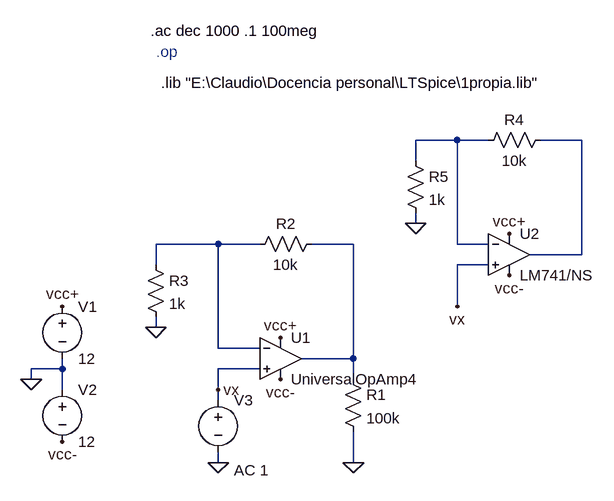
[diagram p0: schematic operacional 1.asc]
operacional 1.asc, the LTspice schematic file:
Version 4
SHEET 1 880 680
WIRE 592 -176 528 -176
WIRE 640 -176 592 -176
WIRE 784 -176 720 -176
WIRE 528 -144 528 -176
WIRE 528 -48 528 -64
WIRE 224 -16 128 -16
WIRE 288 -16 224 -16
WIRE 432 -16 368 -16
WIRE 592 -16 592 -176
WIRE 640 -16 592 -16
WIRE 784 0 784 -176
WIRE 784 0 704 0
WIRE 128 16 128 -16
WIRE 640 16 592 16
WIRE 592 80 592 16
WIRE 128 112 128 96
WIRE 224 144 224 -16
WIRE 288 144 224 144
WIRE 432 160 432 -16
WIRE 432 160 352 160
WIRE -16 176 -16 160
WIRE -16 176 -64 176
WIRE 288 176 224 176
WIRE -64 192 -64 176
WIRE 432 192 432 160
WIRE -16 208 -16 176
WIRE 224 208 224 176
WIRE 224 224 224 208
WIRE 224 320 224 304
WIRE 432 320 432 272
FLAG -64 192 0
FLAG -16 80 vcc+
FLAG -16 288 vcc-
FLAG 320 128 vcc+
FLAG 320 192 vcc-
FLAG 128 112 0
FLAG 224 320 0
FLAG 432 320 0
FLAG 672 -32 vcc+
FLAG 672 32 vcc-
FLAG 528 -48 0
FLAG 224 208 vx
FLAG 592 80 vx
DATAFLAG 432 48 ""
DATAFLAG 784 -48 ""
SYMBOL OpAmps\\UniversalOpAmp4 320 160 R0
SYMATTR InstName U1
SYMBOL voltage -16 64 R0
WINDOW 123 0 0 Left 0
WINDOW 39 0 0 Left 0
SYMATTR InstName V1
SYMATTR Value 12
SYMBOL voltage -16 192 R0
WINDOW 123 0 0 Left 0
WINDOW 39 0 0 Left 0
SYMATTR InstName V2
SYMATTR Value 12
SYMBOL voltage 224 208 R0
WINDOW 123 24 124 Left 2
WINDOW 39 0 0 Left 0
SYMATTR Value2 AC 1
SYMATTR InstName V3
SYMATTR Value ""
SYMBOL res 416 176 R0
SYMATTR InstName R1
SYMATTR Value 100k
SYMBOL res 384 -32 R90
WINDOW 0 0 56 VBottom 2
WINDOW 3 32 56 VTop 2
SYMATTR InstName R2
SYMATTR Value 10k
SYMBOL res 112 0 R0
SYMATTR InstName R3
SYMATTR Value 1k
SYMBOL OpAmps\\opamp2 672 -64 R0
SYMATTR InstName U2
SYMATTR Value LM741/NS
SYMBOL res 736 -192 R90
WINDOW 0 0 56 VBottom 2
WINDOW 3 32 56 VTop 2
SYMATTR InstName R4
SYMATTR Value 10k
SYMBOL res 512 -160 R0
SYMATTR InstName R5
SYMATTR Value 1k
TEXT 128 -312 Left 2 ;.op
TEXT 120 -344 Left 2 !.ac dec 1000 .1 100meg
TEXT 136 -264 Left 2 !.lib "E:\\Claudio\\Docencia personal\\LTSpice\\1propia.lib"

The netlist it stands for:
* operacional 1.asc
* U1: UniversalOpAmp4 (symbol OpAmps\UniversalOpAmp4 not available, pins judged from their places): In+=vx In-=N003 V+=vcc+ V-=vcc- OUT=N004
V1 vcc+ 0 12
V2 0 vcc- 12
V3 vx 0 AC 1
R1 N004 0 100k
R2 N004 N003 10k
R3 N003 0 1k
XU2 vx N001 vcc+ vcc- N002 LM741/NS  ; pins In+ In- V+ V- OUT
R4 N002 N001 10k
R5 N001 0 1k
* .op
.ac dec 1000 .1 100meg
.lib "E:\Claudio\Docencia personal\LTSpice\1propia.lib"
.backanno
.end